# Altium schematic sheet Sheet2.SchDoc
size A4; SheetNumber: 2; SheetTotal: 4
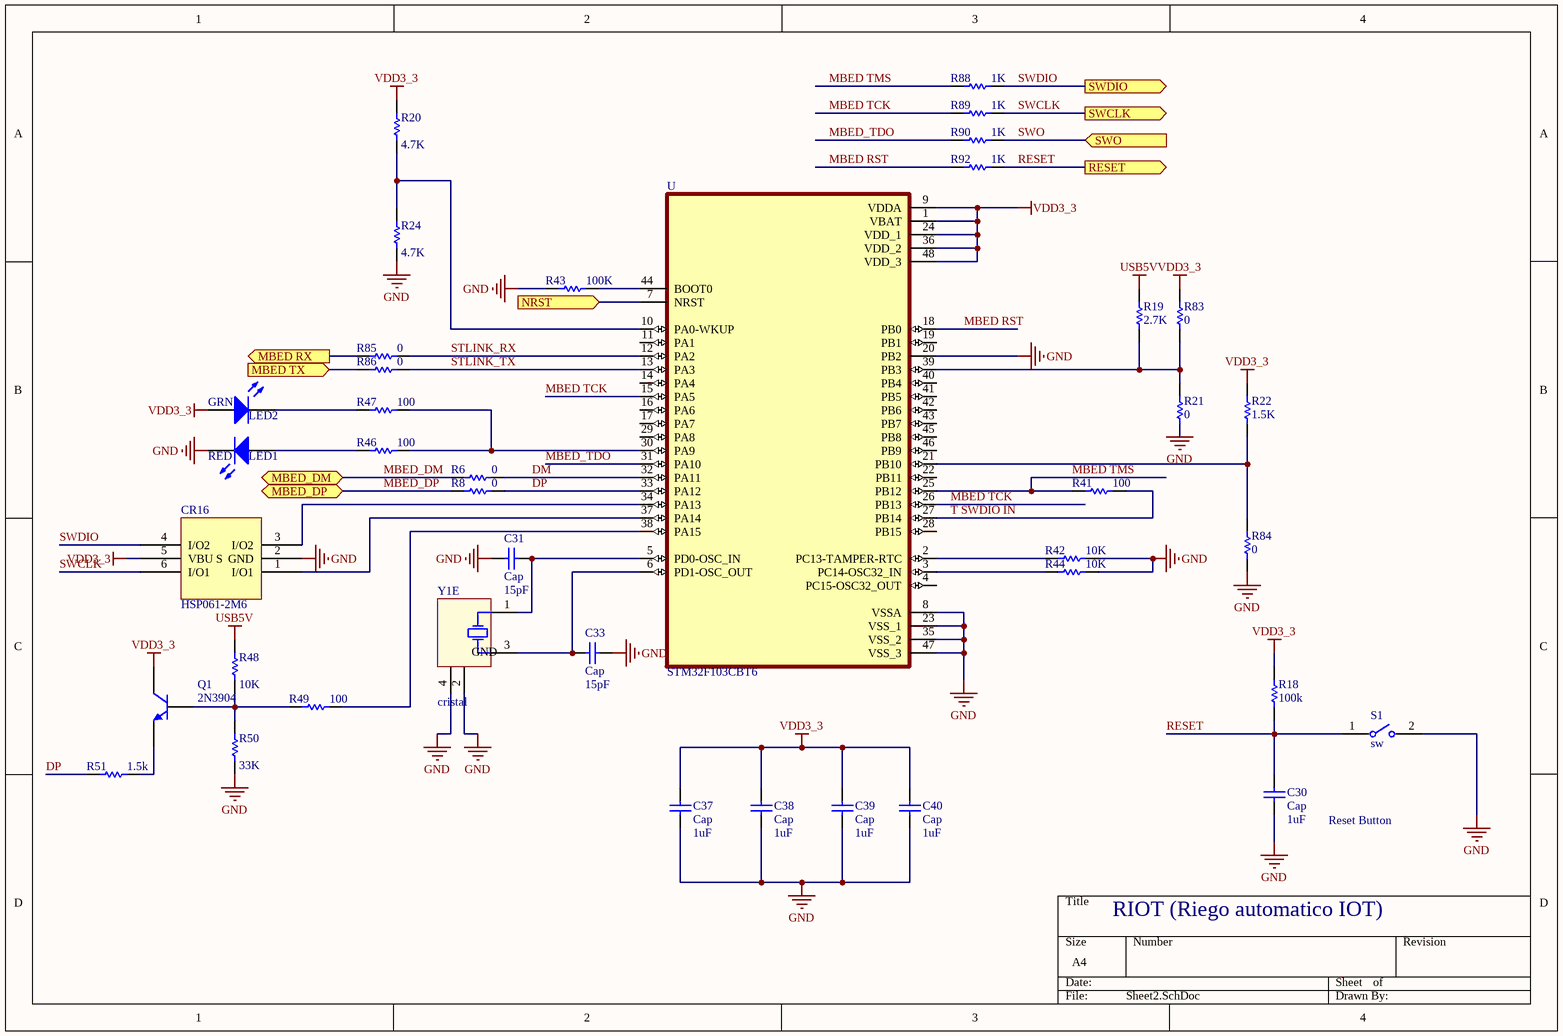
[diagram p0: Sheet2.SchDoc]

## Parts
C30  Cap  value 1uF  [CAPC1005X35N]
C31  Cap  value 15pF  [CAPC1005X35N]
C33  Cap  value 15pF  [CAPC1005X35N]
C37  Cap  value 1uF  [CAPC1005X35N]
C38  Cap  value 1uF  [CAPC1005X35N]
C39  Cap  value 1uF  [CAPC1005X35N]
C40  Cap  value 1uF  [CAPC1005X35N]
CR16  HSP061-2M6  [PSON40P120X130X55-6N]
GRN  LED2  [FP-SML-P11MTT86-MFG]
Q1  2N3904  [TO-92A]
R6  value 0  [RESC1005X35N]  (hidden comment: Res1)
R8  value 0  [RESC1005X35N]  (hidden comment: Res1)
R18  value 100k  [RESC1005X35N]  (hidden comment: Res1)
R19  value 2.7K  [RESC1005X35N]  (hidden comment: Res1)
R20  value 4.7K  [RESC1005X35N]  (hidden comment: Res1)
R21  value 0  [RESC1005X35N]  (hidden comment: Res1)
R22  value 1.5K  [RESC1005X35N]  (hidden comment: Res1)
R24  value 4.7K  [RESC1005X35N]  (hidden comment: Res1)
R41  value 100  [RESC1005X35N]  (hidden comment: Res1)
R42  value 10K  [RESC1005X35N]  (hidden comment: Res1)
R43  value 100K  [RESC1005X35N]  (hidden comment: Res1)
R44  value 10K  [RESC1005X35N]  (hidden comment: Res1)
R46  value 100  [RESC1005X35N]  (hidden comment: Res1)
R47  value 100  [RESC1005X35N]  (hidden comment: Res1)
R48  value 10K  [RESC1005X35N]  (hidden comment: Res1)
R49  value 100  [RESC1005X35N]  (hidden comment: Res1)
R50  value 33K  [RESC1005X35N]  (hidden comment: Res1)
R51  value 1.5k  [RESC1005X35N]  (hidden comment: Res1)
R83  value 0  [RESC1005X35N]  (hidden comment: Res1)
R84  value 0  [RESC1005X35N]  (hidden comment: Res1)
R85  value 0  [RESC1005X35N]  (hidden comment: Res1)
R86  value 0  [RESC1005X35N]  (hidden comment: Res1)
R88  value 1K  [RESC1005X35N]  (hidden comment: Res1)
R89  value 1K  [RESC1005X35N]  (hidden comment: Res1)
R90  value 1K  [RESC1005X35N]  (hidden comment: Res1)
R92  value 1K  [RESC1005X35N]  (hidden comment: Res1)
RED  LED1  [FP-SML-P11MTT86-MFG]
S1  sw  [SW_B3U-1000P]
U  STM32F103CBT6  [STM-LQFP48_N]
Y1  cristal  [ABRA-ABMM2-4_V]  (part E of 5)

## Ports
MBED RX (out), MBED TX (in), MBED_DM (bidir), MBED_DP (bidir), NRST (in), RESET (out), SWCLK (out), SWDIO (out), SWO (in)

## Nets
GND: C30.1 C31.1 C33.2 C37.1 C38.1 C39.1 C40.1 CR16.2(GND) R21.1 R24.1 R42.2 R43.1 R44.2 R50.1 R84.1 RED.2(K) S1.2 U.8(VSSA) U.20(PB2) U.23(VSS_1) U.35(VSS_2) U.47(VSS_3) Y1.2(GND) Y1.4(GND)
USB5V: R19.2 R48.2
VDD3_3: C37.2 C38.2 C39.2 C40.2 CR16.5(VBU_S) GRN.1(A) Q1.3(C) R18.2 R20.2 R22.2 R83.2 U.1(VBAT) U.9(VDDA) U.24(VDD_1) U.36(VDD_2) U.48(VDD_3)
DM: R6.2 U.32(PA11)
DP: R8.2 R51.1 U.33(PA12)
MBED RST: R92.1 U.18(PB0)
MBED RX: R85.1 ; port MBED RX
MBED TCK: R89.1 U.15(PA5) U.26(PB13)
MBED TMS: R41.1 R88.1 U.25(PB12)
MBED TX: R86.1 ; port MBED TX
MBED_DM: R6.1 ; port MBED_DM
MBED_DP: R8.1 ; port MBED_DP
MBED_TDO: R90.1 U.31(PA10)
NRST: U.7(NRST) ; port NRST
RESET: C30.2 R18.1 R92.2 S1.1 ; port RESET
STLINK_RX: R85.2 U.12(PA2)
STLINK_TX: R86.2 U.13(PA3)
SWCLK: CR16.6(I/O1) R89.2 ; port SWCLK
SWDIO: CR16.4(I/O2) R88.2 ; port SWDIO
SWO: R90.2 ; port SWO
T SWDIO IN: R41.2 U.27(PB14)
NetC31_2: C31.2 U.5(PD0-OSC_IN) Y1.1(X1)
NetC33_1: C33.1 U.6(PD1-OSC_OUT) Y1.3(X2)
NetCR16_1: CR16.1(I/O1) U.37(PA14)
NetCR16_3: CR16.3(I/O2) U.34(PA13)
NetGRN_2: GRN.2(K) R47.1
NetQ1_1: Q1.1(E) R51.2
NetQ1_2: Q1.2(B) R48.1 R49.1 R50.2
NetR19_1: R19.1 R21.2 R83.1 U.39(PB3)
NetR20_1: R20.1 R24.2 U.10(PA0-WKUP)
NetR22_1: R22.1 R84.2 U.21(PB10)
NetR42_1: R42.1 U.2(PC13-TAMPER-RTC)
NetR43_2: R43.2 U.44(BOOT0)
NetR44_1: R44.1 U.3(PC14-OSC32_IN)
NetR46_1: R46.1 RED.1(A)
NetR46_2: R46.2 R47.2 U.30(PA9)
NetR49_2: R49.2 U.38(PA15)

Not connected (* = marked no-connect by the designer): U 4(PC15-OSC32_OUT) 11(PA1) 14(PA4) 16(PA6) 17(PA7) 19(PB1) 22(PB11) 28(PB15) 29(PA8) 40(PB4) 41(PB5) 42(PB6) 43(PB7) 45(PB8) 46(PB9)

## Notes on the sheet
- Reset Button
- RIOT (Riego automatico IOT)

## Library data of the parts
C30 C31 C33 C37-C40 = Cap: Capacitor; Published: 8-Jun-2000; LatestRevisionDate: 17-Jul-2002; LatestRevisionNote: Re-released for DXP Platform.; PackageReference: RAD-0.3; Publisher: Altium Limited; PackageDescription: Radial Cap, Thru-Hole; 2 Leads; 0.3 in Pin Spacing
GRN RED = LED0: Typical INFRARED GaAs LED; Published: 8-Jun-2000; LatestRevisionDate: 08-Jul-2005; LatestRevisionNote: Mech Layer 1 removed.; PackageReference: LED-0; Publisher: Altium Limited; PackageDescription: LED; 2 Leads
Q1 = 2N3904: NPN General Purpose Amplifier; Published: 8-Jun-2000; LatestRevisionDate: 15-Jan-2003; LatestRevisionNote: PCB Footprint 'BCY-W3/D4.7' replaced; DatasheetVersion: 1997; PackageVersion: Sep-1998; PackageReference: TO-92A; Publisher: Altium Limited; PackageDescription: TO, Flat Index; 3 In-Line, Axial Leads; Body Dia. 4.5mm; Leads 0.51 x 0.48 mm (max); ComponentLink1Description: Manufacturer Link; ComponentLink1URL: http://www.fairchildsemi.com/; ComponentLink2Description: Datasheet; ComponentLink2URL: http://www.fairchildsemi.com/ds/2N%2F2N3904.pdf
R6 R8 R18-R22 R24 R41-R44 R46-R51 R83-R86 R88-R90 R92 = Res1: Resistor; Published: 8-Jun-2000; LatestRevisionDate: 17-Jul-2002; LatestRevisionNote: Re-released for DXP Platform.; PackageReference: AXIAL-0.3; Publisher: Altium Limited; PackageDescription: Axial Device, Thru-Hole; 2 Leads; 0.3 in Pin Spacing
U = STM32F103CBT6: ARMÂ® CortexÂ®-M3 STM32F1 Microcontroller IC 32-Bit 72MHz 128KB _128K x 8_ FLASH; MF: STMicroelectronics; Package: LQFP-48 STMicroelectronics; Availability: Unavailable; MP: STM32F103CBT6; Value: *; SnapEDA_Link: https://www.snapeda.com/parts/STM32F103CBT6/STMicroelectronics/view-part/38865/?ref=snap; Price: None